# EAGLE design ATS (EAGLE 9.6.2)
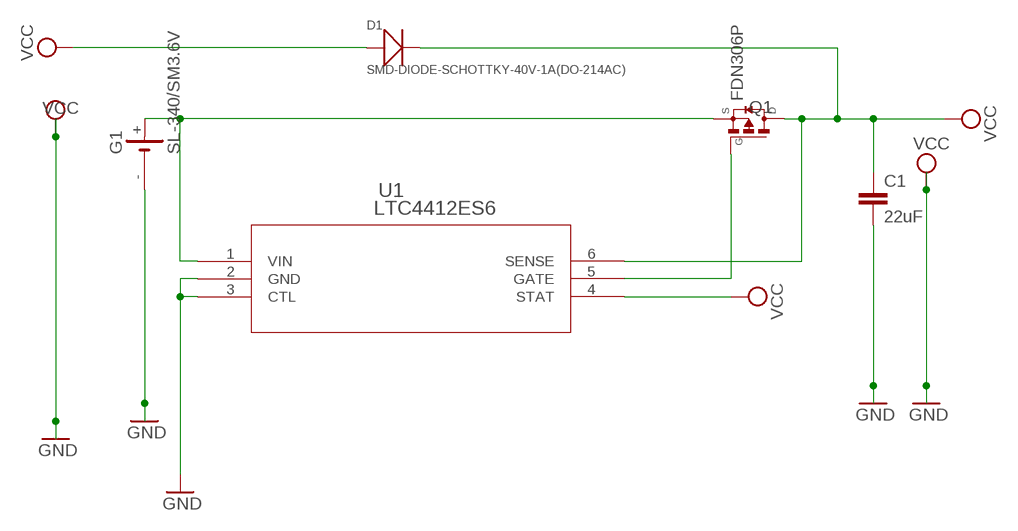
[diagram p0: schematic, sheet 1]

## Parts
C1  22uF  C2,5-3  [C2.5-3]
D1  SMD-DIODE-SCHOTTKY-40V-1A(DO-214AC)  [DO-214AC]
G1  SL-340/SM3.6V  [SL-340/SM3.6V]
Q1  FDN306P  [SSOT-3]
U1  LTC4412ES6  [TSOT-23_S6]

## Nets
GND: C1.2 G1.- U1.2(GND) U1.3(CTL) ; supply symbol labelled VCC
N$5: Q1.1(G) U1.5(GATE)
N$8: G1.+ Q1.2(S) U1.1(VIN)
VCC: C1.1 D1.1(+) D1.2(-) Q1.3(D) U1.4(STAT) U1.6(SENSE)
Unconnected: G1.-@1(-)

## Library data of the parts
C1 = capacitor-wima:C: CAPACITOR naming: grid - package width
D1 = SMD-DIODE-SCHOTTKY-40V-1A_DO-214AC_:SMD-DIODE-SCHOTTKY-40V-1A(DO-214AC): 304020027 Check availability <https://pricing.snapeda.com/parts/1N5819/ON%20Semiconductor/view-part?ref=eda>; AVAILABILITY: In Stock; DESCRIPTION: Diode Schottky 40 V 1A Through Hole Axial; MF: ON Semiconductor; MP: 1N5819; PACKAGE: DO-41-2 ON Semiconductor; PRICE: None
G1 = battery:SL-340/SM3.6V: LI BATTERY Sonnenschein
Q1 = FDN306P:FDN306P: P-Channel MOSFET 1.8V Specified PowerTrench Check availability <https://pricing.snapeda.com/parts/FDN306P./ON%20Semiconductor/view-part?ref=eda>; AVAILABILITY: Not in stock; DESCRIPTION: MOSFET, P CH, -12V, -2.6A, SUPERSOT; Transistor Polarity: P Channel; Continuous Drain Current Id: -2.6A; Drain Source Voltage Vds: -12V; On Resistance Rds(on): 0.03ohm; Rds(on) Test Voltage Vgs: -4.5V; Threshold Voltage Vgs: -600mV; Power Dissipation Pd: 500mW; Transistor Case Style: SuperSOT; No. of Pins: 3Pins; Operating Temperature Max: 150°C; Product Range: -; Automotive Qualification Standard: -; MSL: MSL 1 - Unlimited; SVHC: No SVHC (15-Jan-2018); Operating Temperature Min: -55°C; MF: ON Semiconductor; MP: FDN306P.; PACKAGE: None; PRICE: None
U1 = LTC4412ES6:LTC4412ES6: Check availability <https://pricing.snapeda.com/parts/LTC4412ES6/Analog%20Devices/view-part?ref=eda>; AVAILABILITY: In Stock; DESCRIPTION: OR Controller Source Selector Switch P-Channel 2:1 TSOT-23-6; MF: Analog Devices; MP: LTC4412ES6; PACKAGE: SOT-23-6 Linear Technology; PRICE: None

## Board
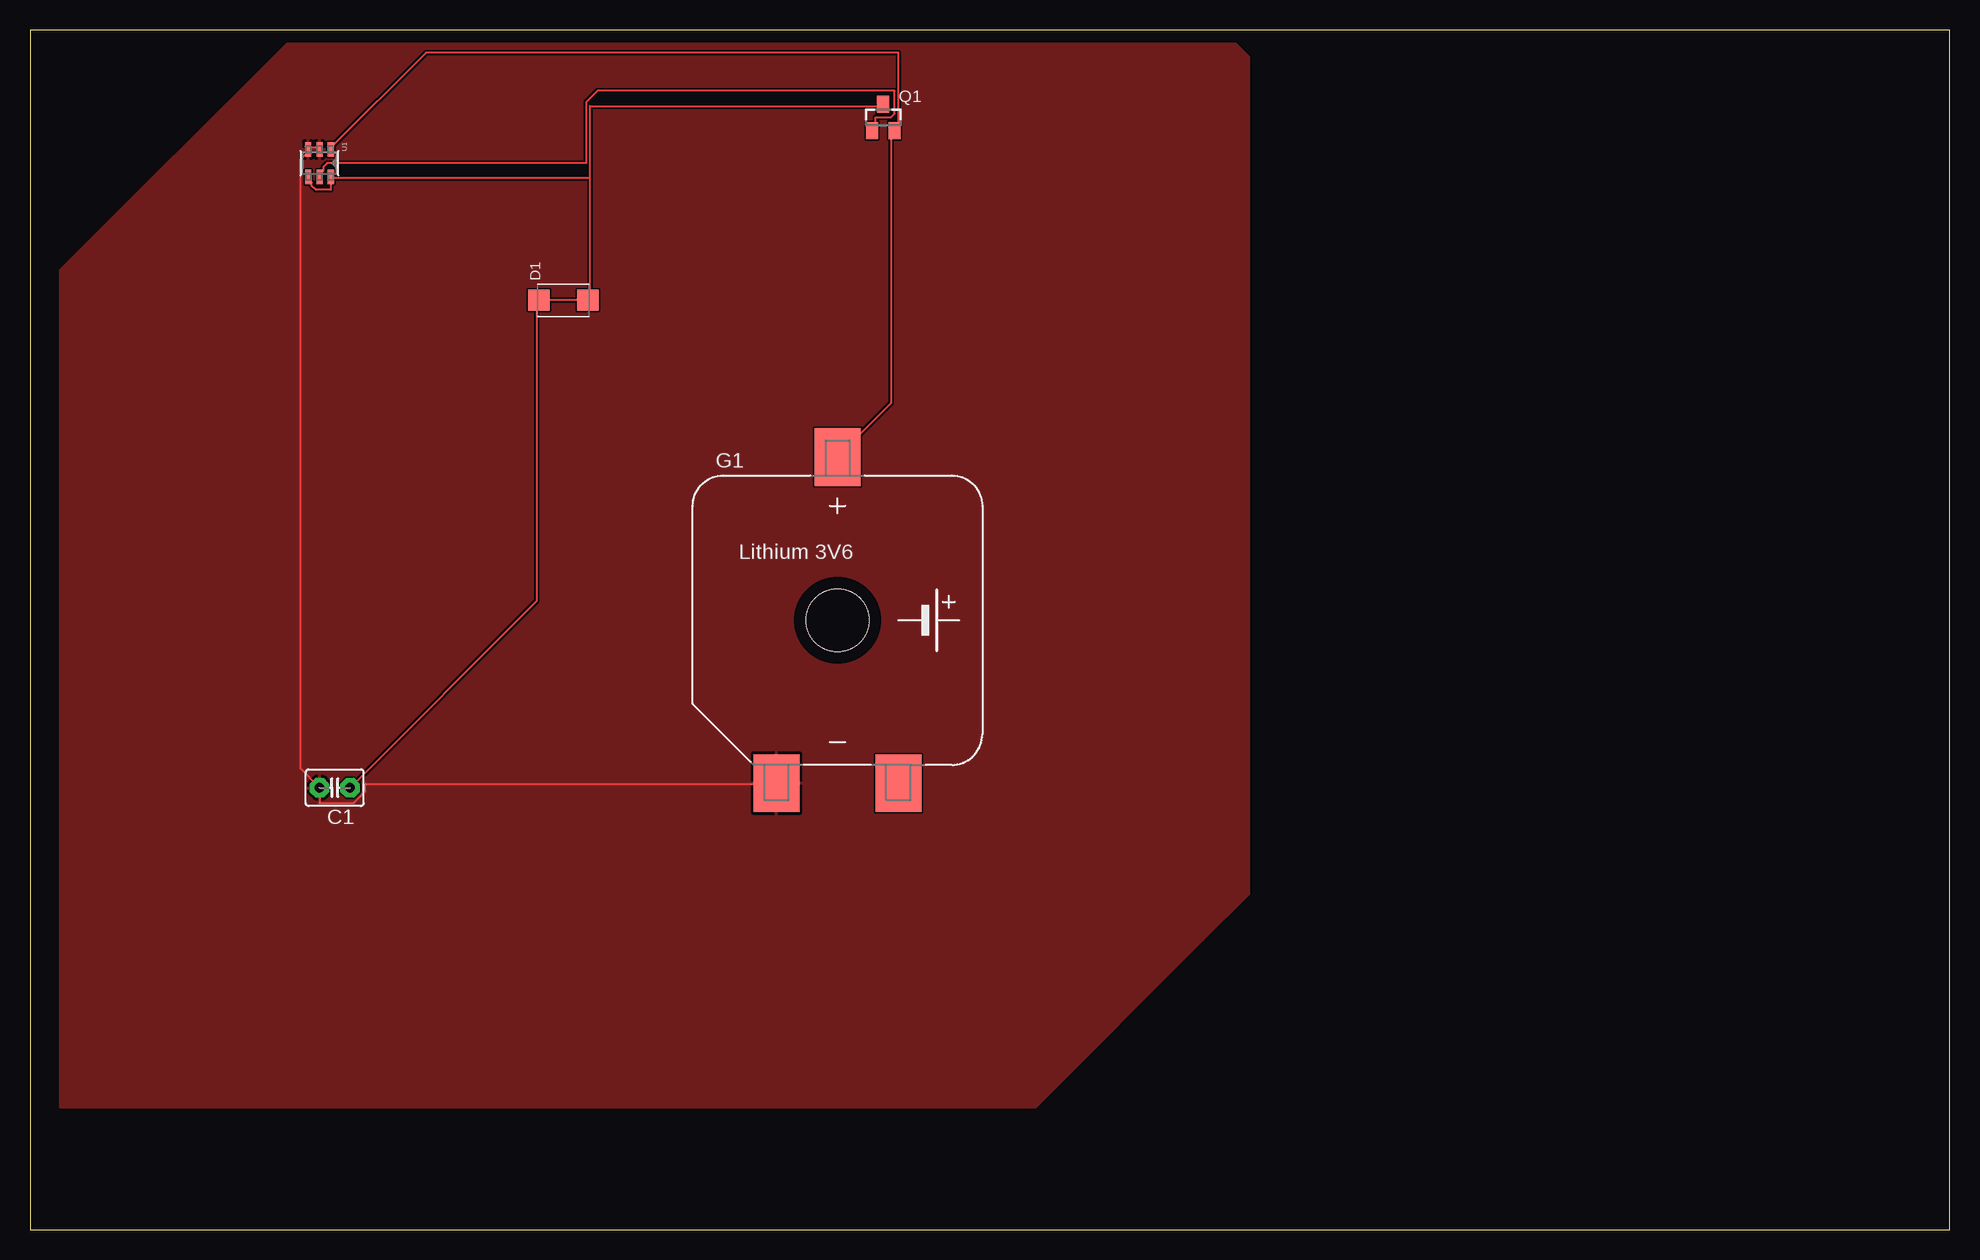
[diagram p1: board, top side]

Size 160 x 100 mm. Coordinates in mm from the lower left corner, seen from the top.
Outline: 0,0 160,0 160,100 0,100 0,0
Copper layers (1*16): Top 0.035mm / dielectric 1.5mm / Bottom 0.035mm
Design rules "default": minimum track width 6mil, minimum drill 0.35mm, track to track 6mil, track to pad 6mil, pad to pad 6mil, via to via 6mil, smd to smd 6mil, copper to edge 40mil, drill to drill 6mil, minimum pad ring 10mil, minimum via ring 8mil, stop-mask expansion 4mil, vias tented up to drill 0mil, thermal gap 10mil

### Footprints (pad centres in the part's own frame; a part is rotated, then mirrored left to right if it is on the bottom)
C2.5-3 = drill 0.813 pad 1.6 octagon: 1 -1.27,0; 2 1.27,0
DO-214AC = smd 1.8 x 1.77: 1 -2.042,0; 2 2.042,0
SL-340/SM3.6V = smd 3.81 x 4.826: + 0,13.589; - -5.08,-13.589; -@1 5.08,-13.589 | hole 5.2: 0,0
SSOT-3 = smd 1 x 1.4: 1 -0.95,-1.1; 2 0.95,-1.1; 3 0,1.1
TSOT-23_S6 = smd 1.219 x 0.508: 1 -1.143,0.95; 2 -1.143,0; 3 -1.143,-0.95; 4 1.143,-0.95; 5 1.143,0; 6 1.143,0.95

### Placement (x,y rotation side)
C1  25.4,36.83 180 top
D1  44.45,77.47 0 top
G1  67.31,50.8 0 top
Q1  71.12,92.71 0 top
U1  24.13,88.9 270 top

### Tracks (layer width: path | path; a pad name or v marks a point on that pad's centre or on a via)
GND
  Top 0.152: U1.2 24.13,90.17 23.18,90.17 U1.3 23.18,89.85 22.54,89.22 22.54,38.42 C1.2 24.13,35.56 26.99,35.56 27.94,36.51 27.94,37.15 62.23,37.15 G1.-
  pour Top: 2.54,10.16 2.54,80.01 21.59,99.06 100.33,99.06 101.6,97.79 101.6,27.94 97.79,24.13 83.82,10.16
N$5
  Top 0.152: U1.5 24.13,87.95 24.45,88.27 24.45,88.58 24.77,88.9 46.35,88.9 46.35,93.98 47.31,94.93 72.07,94.93 72.07,93.03 71.75,92.71 70.48,92.71 70.48,91.76 Q1.1
N$8
  Top 0.152: U1.1 25.08,90.17 33.02,98.11 72.39,98.11 72.39,92.08 72.07,91.76 Q1.2 71.75,91.44 71.75,68.9 67.31,64.45 G1.+
VCC
  Top 0.152: 25.08,87.63 25.08,86.68 23.81,86.68 23.5,87 23.5,87.31 23.18,87.63 U1.4 | 46.67,87.63 46.67,77.47 D1.2 D1.1 42.23,77.47 42.23,52.39 C1.1 | 46.67,87.63 46.67,93.66 71.12,93.66 Q1.3 | 46.67,87.63 25.08,87.63 | 25.08,87.63 U1.6